# Altium schematic sheet MODULE_STRAPS_MD.SchDoc: MODULE STRAPS MD
size A3; Author: Silvio Navaretti; CompanyName: ARDUINO; DrawnBy: Silvio Navaretti; Engineer: Silvio Navaretti; Organization: ARDUINO; SheetNumber: 7; SheetTotal: 51; RevAuthor: Silvio Navaretti
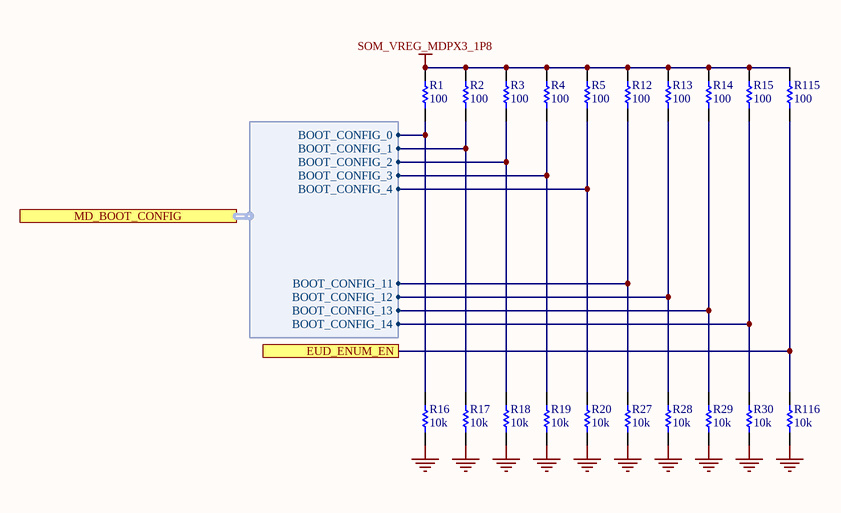
[diagram p0: MODULE_STRAPS_MD.SchDoc]

## Parts
R1  value 100  [RES-0201]  (hidden comment: RC0201FR-07100RL)
R2  value 100  [RES-0201]  (hidden comment: RC0201FR-07100RL)
R3  value 100  [RES-0201]  (hidden comment: RC0201FR-07100RL)
R4  value 100  [RES-0201]  (hidden comment: RC0201FR-07100RL)
R5  value 100  [RES-0201]  (hidden comment: RC0201FR-07100RL)
R12  value 100  [RES-0201]  (hidden comment: RC0201FR-07100RL)
R13  value 100  [RES-0201]  (hidden comment: RC0201FR-07100RL)
R14  value 100  [RES-0201]  (hidden comment: RC0201FR-07100RL)
R15  value 100  [RES-0201]  (hidden comment: RC0201FR-07100RL)
R16  value 10k  [RES-0201]  (hidden comment: RC0201FR-0710KL)
R17  value 10k  [RES-0201]  (hidden comment: RC0201FR-0710KL)
R18  value 10k  [RES-0201]  (hidden comment: RC0201FR-0710KL)
R19  value 10k  [RES-0201]  (hidden comment: RC0201FR-0710KL)
R20  value 10k  [RES-0201]  (hidden comment: RC0201FR-0710KL)
R27  value 10k  [RES-0201]  (hidden comment: RC0201FR-0710KL)
R28  value 10k  [RES-0201]  (hidden comment: RC0201FR-0710KL)
R29  value 10k  [RES-0201]  (hidden comment: RC0201FR-0710KL)
R30  value 10k  [RES-0201]  (hidden comment: RC0201FR-0710KL)
R115  value 100  [RES-0201]  (hidden comment: RC0201FR-07100RL)
R116  value 10k  [RES-0201]  (hidden comment: RC0201FR-0710KL)

## Ports
EUD_ENUM_EN, MD_BOOT_CONFIG (harness SOM_MD_BOOT_CONFIG)

## Harnesses
SOM_MD_BOOT_CONFIG: BOOT_CONFIG_0, BOOT_CONFIG_1, BOOT_CONFIG_2, BOOT_CONFIG_3, BOOT_CONFIG_4, BOOT_CONFIG_11, BOOT_CONFIG_12, BOOT_CONFIG_13, BOOT_CONFIG_14

## Nets
GND: R16.1 R17.1 R18.1 R19.1 R20.1 R27.1 R28.1 R29.1 R30.1 R116.1
SOM_VREG_MDPX3_1P8: R1.1 R2.1 R3.1 R4.1 R5.1 R12.1 R13.1 R14.1 R15.1 R115.1
EUD_ENUM_EN: R115.2 R116.2 ; port EUD_ENUM_EN
NetR1_2: R1.2 R16.2 ; port MD_BOOT_CONFIG.BOOT_CONFIG_0
NetR2_2: R2.2 R17.2 ; port MD_BOOT_CONFIG.BOOT_CONFIG_1
NetR3_2: R3.2 R18.2 ; port MD_BOOT_CONFIG.BOOT_CONFIG_2
NetR4_2: R4.2 R19.2 ; port MD_BOOT_CONFIG.BOOT_CONFIG_3
NetR5_2: R5.2 R20.2 ; port MD_BOOT_CONFIG.BOOT_CONFIG_4
NetR12_2: R12.2 R27.2 ; port MD_BOOT_CONFIG.BOOT_CONFIG_11
NetR13_2: R13.2 R28.2 ; port MD_BOOT_CONFIG.BOOT_CONFIG_12
NetR14_2: R14.2 R29.2 ; port MD_BOOT_CONFIG.BOOT_CONFIG_13
NetR15_2: R15.2 R30.2 ; port MD_BOOT_CONFIG.BOOT_CONFIG_14

## Notes on the sheet
- Title:
- ID:
- Date:
- Time:
- Version:
- Sheet
- of
- RevAuthor:
- Reference Designs ARE PROVIDED "AS IS" AND "WITH ALL FAULTS. Arduino SA DISCLAIMS ALL OTHER WARRANTIES, EXPRESS OR IMPLIED, REGARDING PRODUCTS, INCLUDING BUT NOT LIMITED TO, ANY IMPLIED WARRANTIES OF MERCHANTABILITY OR FITNESS FOR A PARTICULAR PURPOSE.
  Arduino SA may make changes to specifications and product descriptions at any time, without notice. The Customer must not rely on the absence or characteristics of any features or instructions marked "reserved" or "undefined".
  Arduino SA reserves these for future definition and shall have no responsibility whatsoever for conflicts or incompatibilities arising from future changes to them. The product information on the Web Site or Materials is subject to change without notice.
  Do not finalize a design with this info. ARDUINO and other Arduino brands and logos and Trademarks of Arduino SA. All Arduino SA Trademarks cannot be used without owner's formal permission.
- File:
- Author:

## Library data of the parts
R1-R5 R12-R15 R115 = R0235-A.13: RES CHIP 0201 100R 1% 1/20W; Manufacturer: YAGEO; Power: 50mW; Temperature coefficient: 200ppm; Code Arduino: R0235; Tolerance: 1%; Case Code (Imperial): 0201; Technology: Thick film; Part Number: RC0201FR-07100RL
R16-R20 R27-R30 R116 = R0145-A.21: RES CHIP 0201 10k 1% 1/20W; Manufacturer: Yageo; Power: 50mW; Temperature coefficient: 200ppm; Code Arduino: R0145; Manufacturer 2: Samsung Electro-Mechanics; Tolerance: 1%; Case Code (Imperial): 0201; Part Number: RC0201FR-0710KL; Technology: Thick film